# EAGLE design pentalight_1layer (EAGLE 5.11)
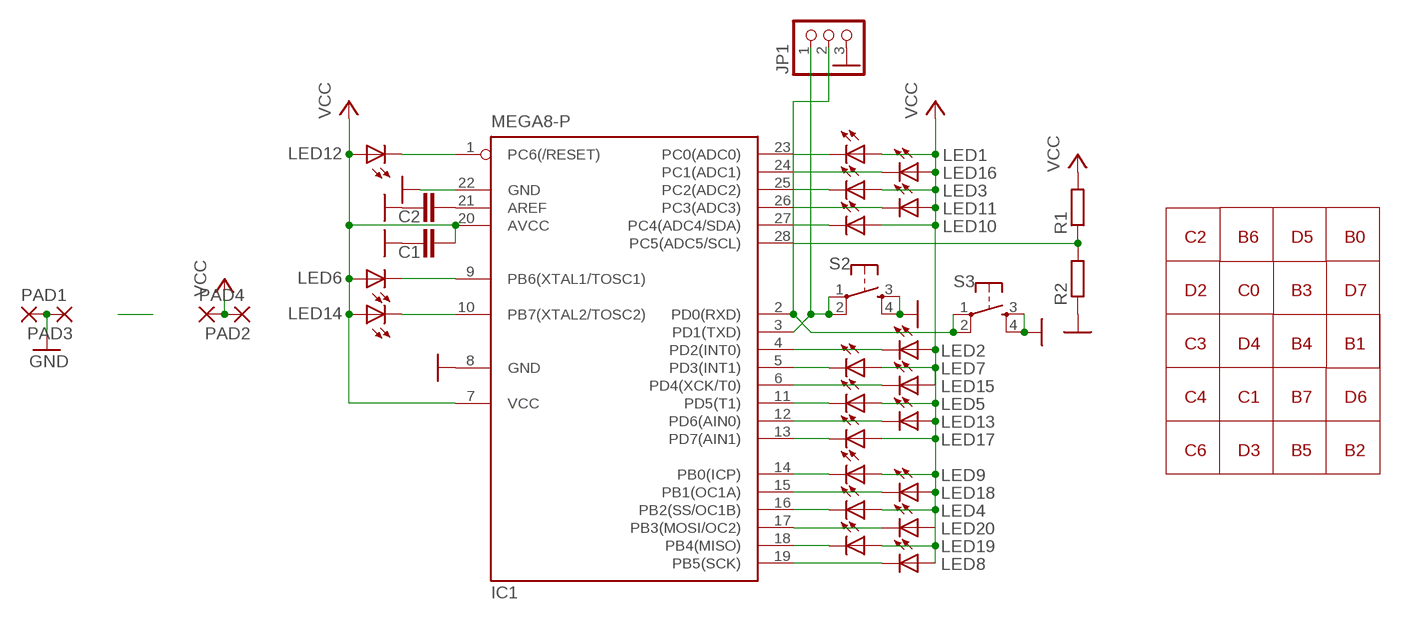
[diagram p0: schematic, sheet 1]

## Parts
C1  C-EU025-024X044  [C025-024X044]
C2  C-EU025-024X044  [C025-024X044]
IC1  MEGA8-P  [DIL28-3]
JP1  PINHD-1X3  [1X03]
LED1  LED5MM  [LED5MM]
LED2  LED5MM  [LED5MM]
LED3  LED5MM  [LED5MM]
LED4  LED5MM  [LED5MM]
LED5  LED5MM  [LED5MM]
LED6  LED5MM  [LED5MM]
LED7  LED5MM  [LED5MM]
LED8  LED5MM  [LED5MM]
LED9  LED5MM  [LED5MM]
LED10  LED5MM  [LED5MM]
LED11  LED5MM  [LED5MM]
LED12  LED5MM  [LED5MM]
LED13  LED5MM  [LED5MM]
LED14  LED5MM  [LED5MM]
LED15  LED5MM  [LED5MM]
LED16  LED5MM  [LED5MM]
LED17  LED5MM  [LED5MM]
LED18  LED5MM  [LED5MM]
LED19  LED5MM  [LED5MM]
LED20  LED5MM  [LED5MM]
PAD1  SMD5  [SMD2,54-5,08]
PAD2  SMD5  [SMD2,54-5,08]
PAD3  2,54/1,0  [2,54/1,0]
PAD4  2,54/1,0  [2,54/1,0]
R1  R-EU_0204/7  [0204/7]
R2  R-EU_0204/7  [0204/7]
S2  TAC_SWITCHPTH  [TACTILE-PTH]
S3  TAC_SWITCHPTH  [TACTILE-PTH]

## Nets
GND: C1.1 C2.1 IC1.8(GND) IC1.22(GND) JP1.3 PAD1.1(P) PAD3.1(P) R2.1 S2.3 S2.4 S3.3 S3.4
N$1: IC1.18(PB4(MISO)) LED19.K(C)
N$2: IC1.17(PB3(MOSI/OC2)) LED20.K(C)
N$3: IC1.23(PC0(ADC0)) LED1.K(C)
N$4: IC1.4(PD2(INT0)) LED2.K(C)
N$5: IC1.25(PC2(ADC2)) LED3.K(C)
N$6: IC1.16(PB2(SS/OC1B)) LED4.K(C)
N$7: IC1.11(PD5(T1)) LED5.K(C)
N$8: IC1.9(PB6(XTAL1/TOSC1)) LED6.K(C)
N$9: IC1.5(PD3(INT1)) LED7.K(C)
N$10: IC1.19(PB5(SCK)) LED8.K(C)
N$11: IC1.14(PB0(ICP)) LED9.K(C)
N$12: IC1.26(PC3(ADC3)) LED11.K(C)
N$13: IC1.27(PC4(ADC4/SDA)) LED10.K(C)
N$14: IC1.1(PC6(/RESET)) LED12.K(C)
N$16: IC1.10(PB7(XTAL2/TOSC2)) LED14.K(C)
N$17: C2.2 IC1.21(AREF)
N$18: IC1.24(PC1(ADC1)) LED16.K(C)
N$19: IC1.13(PD7(AIN1)) LED17.K(C)
N$20: IC1.15(PB1(OC1A)) LED18.K(C)
N$21: IC1.12(PD6(AIN0)) LED13.K(C)
N$22: IC1.6(PD4(XCK/T0)) LED15.K(C)
N$23: IC1.28(PC5(ADC5/SCL)) R1.1 R2.2
N$27: IC1.3(PD1(TXD)) JP1.1 S2.1 S2.2
N$28: IC1.2(PD0(RXD)) JP1.2 S3.1 S3.2
VCC: C1.2 IC1.7(VCC) IC1.20(AVCC) LED1.A LED2.A LED3.A LED4.A LED5.A LED6.A LED7.A LED8.A LED9.A LED10.A LED11.A LED12.A LED13.A LED14.A LED15.A LED16.A LED17.A LED18.A LED19.A LED20.A PAD2.1(P) PAD4.1(P) R1.2

## Notes on the sheet
- C2 | B6 | D5 | B0
- D2 | C0 | B3 | D7
- C3 | D4 | B4 | B1
- C4 | C1 | B7 | D6
- C6 | D3 | B5 | B2

## Library data of the parts
C1 C2 = resistor:C-EU: CAPACITOR, European symbol
IC1 = atmel:MEGA8-P: MICROCONTROLLER 8 Kbytes FLASH, 1 kbytes SRAM, 512 bytes EEPROM, USART, 4-channel 10 bit ADC, 2-channel 8 bit ADC Pin compatible with Atmega48, ATMega88, ATMega168 Source: avr.lbr; OC_FARNELL: unknown; OC_NEWARK: unknown
JP1 = pinhead:PINHD-1X3: PIN HEADER
LED1-LED20 = SparkFun:LED: LEDs Standard schematic elements and footprints for 5mm, 3mm, 1206, and 0603 sized LEDs. 5mm - Spark Fun Electronics SKU : COM-00529 (and others)
PAD1 PAD2 = wirepad:SMD5: SMD PAD
PAD3 PAD4 = wirepad:2,54/1,0: THROUGH-HOLE PAD
R1 R2 = resistor:R-EU_: RESISTOR, European symbol
S2 S3 = SparkFun:TAC_SWITCH: Momentary Switch Button commonly used for reset or general input. Spark Fun Electronics SKU : COM-00097

## Board
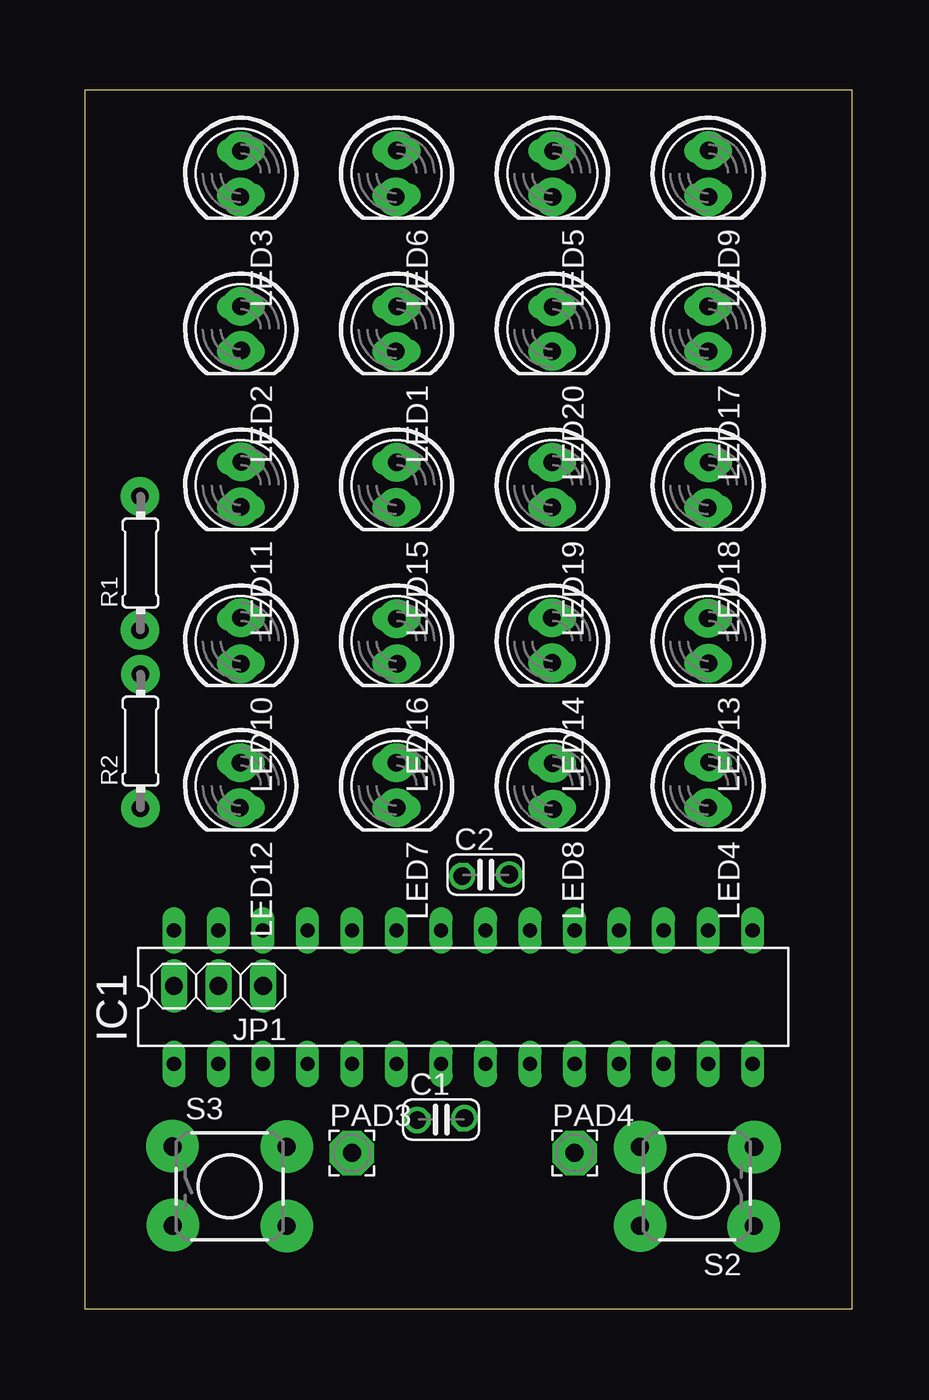
[diagram p1: board, top side]
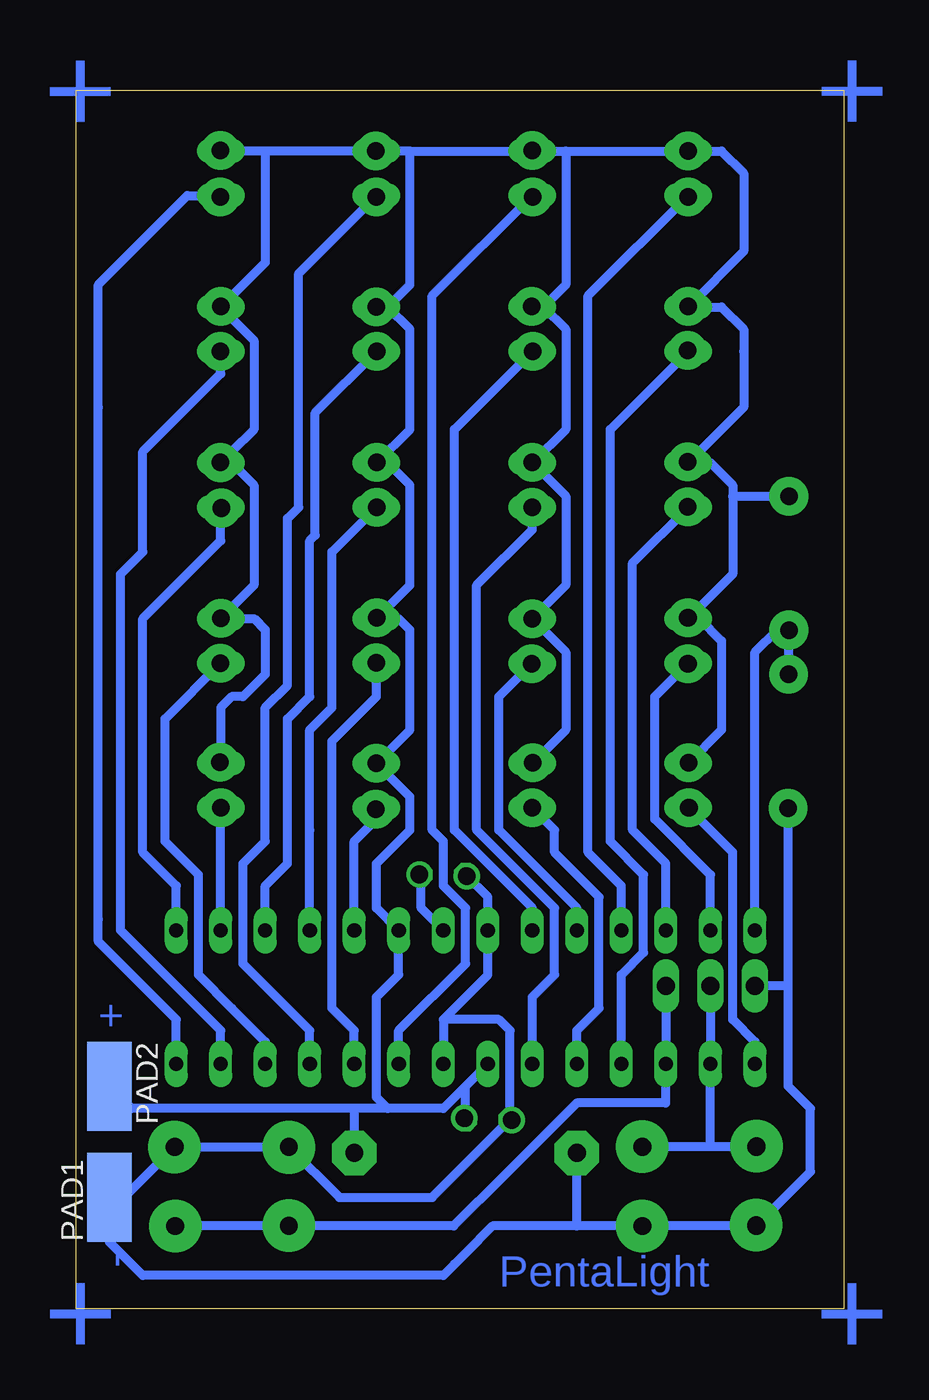
[diagram p2: board, bottom side, seen from below]

Size 43.8 x 69.52 mm. Coordinates in mm from the lower left corner, seen from the top.
Outline: 0,0 43.8,0 43.8,69.52 0,69.52 0,0
Copper layers (1*16): Top 0.035mm / dielectric 1.5mm / Bottom 0.035mm
Design rules "default": minimum track width 10mil, minimum drill 24mil, track to track 8mil, track to pad 8mil, pad to pad 8mil, via to via 8mil, smd to smd 8mil, copper to edge 40mil, drill to drill 8mil, minimum pad ring 10mil, minimum via ring 8mil, stop-mask expansion 4mil, vias tented up to drill 0mil, thermal gap 10mil

### Footprints (pad centres in the part's own frame; a part is rotated, then mirrored left to right if it is on the bottom)
C025-024X044 = drill 0.813 octagon: 1 -1.27,0; 2 1.27,0
DIL28-3 = drill 0.813 long: 1 -16.51,-3.81; 2 -13.97,-3.81; 3 -11.43,-3.81; 4 -8.89,-3.81; 5 -6.35,-3.81; 6 -3.81,-3.81; 7 -1.27,-3.81; 8 1.27,-3.81; 9 3.81,-3.81; 10 6.35,-3.81; 11 8.89,-3.81; 12 11.43,-3.81; 13 13.97,-3.81; 14 16.51,-3.81; 15 16.51,3.81; 16 13.97,3.81; 17 11.43,3.81; 18 8.89,3.81; 19 6.35,3.81; 20 3.81,3.81; 21 1.27,3.81; 22 -1.27,3.81; 23 -3.81,3.81; 24 -6.35,3.81; 25 -8.89,3.81; 26 -11.43,3.81; 27 -13.97,3.81; 28 -16.51,3.81
1X03 = drill 1.016 long: 1 -2.54,0; 2 0,0; 3 2.54,0
LED5MM = drill 0.813 pad 1.372 long: A -1.27,0; K 1.27,0
SMD2,54-5,08 = smd 2.54 x 5.08: 1 0,0
2,54/1,0 = drill 1.016 pad 2.54 octagon: 1 0,0
0204/7 = drill 0.813 octagon: 1 -3.81,0; 2 3.81,0
TACTILE-PTH = drill 1.016 pad 1.88 round: 1 -3.251,2.261; 2 3.251,2.261; 3 -3.251,-2.261; 4 3.251,-2.261

### Placement (x,y rotation side)
C1  20.32,10.79 0 top
C2  22.86,24.77 0 top
IC1  21.59,17.78 0 top
JP1  7.62,18.41 180 top
LED1  17.78,55.88 270 top
LED2  8.89,55.88 270 top
LED3  8.89,64.77 270 top
LED4  35.56,29.84 270 top
LED5  26.67,64.77 270 top
LED6  17.78,64.77 270 top
LED7  17.78,29.84 270 top
LED8  26.67,29.84 270 top
LED9  35.56,64.77 270 top
LED10  8.89,38.1 270 top
LED11  8.89,46.99 270 top
LED12  8.89,29.84 270 top
LED13  35.56,38.1 270 top
LED14  26.67,38.1 270 top
LED15  17.78,46.99 270 top
LED16  17.78,38.1 270 top
LED17  35.56,55.88 270 top
LED18  35.56,46.99 270 top
LED19  26.67,46.99 270 top
LED20  26.67,55.88 270 top
PAD1  41.91,6.35 0 bottom
PAD2  41.91,12.7 180 bottom
PAD3  15.24,8.89 0 top
PAD4  27.94,8.89 0 top
R1  3.17,42.55 90 top
R2  3.17,32.38 90 top
S2  34.92,6.99 180 top
S3  8.25,6.99 0 top

### Tracks (layer width: path | path; a pad name or v marks a point on that pad's centre or on a via)
GND
  Bottom 0.5: 22.86,16.51 IC1.8 | 22.86,16.51 20.32,19.05 IC1.22 20.32,23.5 C2.1 | 22.86,16.51 19.69,16.51 19.05,15.88 C1.1 23.49,6.35 25.4,6.35 28.78,6.35 S2.4 S2.3 41.07,6.35 PAD1.1 | 15.24,4.72 S3.4 S3.3 1.9,7.82 1.9,11.43 3.17,12.7 3.17,18.41 | 15.24,4.72 20.04,4.72 21.59,3.17 22.22,2.54 22.86,1.91 40,1.91 41.91,3.81 PAD1.1 | PAD1.1 41.27,5.71 | 3.17,18.41 R2.1 | 15.24,4.72 PAD3.1 | 3.17,18.41 JP1.3
N$1
  Bottom 0.5: LED19.K 29.21,43.18 29.21,34.29 30.48,33.02 30.48,27.3 IC1.18
N$2
  Bottom 0.5: LED20.K 30.16,51.12 30.16,44.13 30.48,43.81 30.48,34.92 31.75,33.66 31.75,25.4 33.02,24.13 IC1.17
N$3
  Bottom 0.5: LED1.K 22.22,50.16 22.22,27.3 17.78,22.86 IC1.23
N$4
  Bottom 0.5: LED2.K 13.33,50.16 13.33,26.67 11.43,24.77 11.43,20.32 12.7,19.05 IC1.4
N$5
  Bottom 0.5: LED3.K 14.6,57.78 14.6,26.04 12.7,24.13 IC1.25
N$6
  Bottom 0.5: IC1.16 LED4.K
N$7
  Bottom 0.5: LED5.K 31.11,59.05 31.11,45.72 31.75,45.09 31.75,35.56 33.02,34.29 33.02,26.67 34.29,25.4 34.29,19.68 30.48,15.88 IC1.11
N$8
  Bottom 0.5: LED6.K 23.49,57.78 23.49,27.3 22.86,26.67 22.86,24.13 21.59,22.86 21.59,19.68 25.4,15.88 IC1.9
N$9
  Bottom 0.5: LED7.K 16.51,27.3 16.51,26.04 13.97,23.5 13.97,17.14 15.24,15.88 IC1.5
N$10
  Bottom 0.5: LED8.K 26.67,27.94 27.94,26.67 IC1.19
N$11
  Bottom 0.5: IC1.14 38.1,16.51 42.55,20.95 42.55,22.23 42.55,51.44 42.55,58.42 37.47,63.5 LED9.K
N$12
  Bottom 0.5: LED11.K 12.06,42.55 12.06,27.3 10.16,25.4 IC1.26
N$13
  Bottom 0.5: LED10.K 10.8,34.92 10.8,27.94 7.62,24.77 IC1.27
N$14
  Bottom 0.5: LED12.K 6.35,26.04 6.35,16.51 5.08,15.24 IC1.1
N$16
  Bottom 0.5: IC1.10 27.94,15.88 29.21,17.14 29.21,27.3 29.21,32.38 26.67,34.92 LED14.K
N$17
  Bottom 0.5: C2.2 24.13,22.86 IC1.21
N$18
  Bottom 0.5: LED16.K 19.69,34.92 19.69,27.3 15.24,22.86 IC1.24
N$19
  Bottom 0.5: IC1.13 35.56,15.88 41.27,21.59 41.27,41.91 40,43.18 40,48.9 35.56,53.34 LED17.K
N$20
  Bottom 0.5: IC1.15 38.1,24.13 40,26.04 40,39.37 35.56,43.81 LED18.K
N$21
  Bottom 0.5: LED13.K 38.73,33.66 38.73,26.67 36.83,24.77 36.83,19.05 34.92,17.14 33.02,15.24 IC1.12
N$22
  Bottom 0.5: LED15.K 17.78,44.45 20.95,41.27 20.95,27.3 16.51,22.86 16.51,19.05 17.78,17.78 IC1.6
N$23
  Bottom 0.5: IC1.28 5.08,37.47 3.81,38.73 R1.1 R2.2
N$24  (via drill 1 pad 3)
  other vias: 5.01,4.77
N$25  (via drill 1 pad 3)
  other vias: 11.51,4.72
N$26  (via drill 1 pad 3)
  other vias: 4.99,9.28
N$27
  Bottom 0.5: S2.1 S2.2 22.26,4.72 19.37,7.62 16.83,10.16 15.24,11.75 10.16,11.75 IC1.3 JP1.1
N$28
  Bottom 0.5: S3.1 7.62,9.25 | 7.62,9.25 S3.2 | 7.62,9.25 7.62,13.82 7.54,13.89 IC1.2 JP1.2
N$29  (via drill 1 pad 3)
  other vias: 11.51,9.26
N$30  (via drill 1 pad 3)
  other vias: 31.68,4.75
N$31  (via drill 1 pad 3)
  other vias: 38.15,4.73
N$32  (via drill 1 pad 3)
  other vias: 38.2,9.24
N$33  (via drill 1 pad 3)
  other vias: 31.68,9.21
N$34  (via drill 1 pad 2.2)
  other vias: 3.18,28.57
N$35  (via drill 1 pad 2.2)
  other vias: 3.16,36.21
N$36  (via drill 1 pad 2.2)
  other vias: 3.14,38.72
N$37  (via drill 1 pad 2.2)
  other vias: 3.14,46.35
N$38  (via drill 1 pad 2.2)
  other vias: 8.89,66.06
N$39  (via drill 1 pad 2.2)
  other vias: 17.8,66.08
N$40  (via drill 1 pad 2.2)
  other vias: 26.71,66.04
N$41  (via drill 1 pad 2.2)
  other vias: 35.58,66.07
N$42  (via drill 1 pad 2.2)
  other vias: 35.55,57.19
N$43  (via drill 1 pad 2.2)
  other vias: 26.68,57.17
N$44  (via drill 1 pad 2.2)
  other vias: 17.82,57.18
N$45  (via drill 1 pad 2.2)
  other vias: 8.89,57.18
N$46  (via drill 1 pad 2.2)
  other vias: 8.92,48.31
N$47  (via drill 1 pad 2.2)
  other vias: 17.79,48.29
N$48  (via drill 1 pad 2.2)
  other vias: 26.66,48.3
N$49  (via drill 1 pad 2.2)
  other vias: 35.59,48.28
N$50  (via drill 1 pad 2.2)
  other vias: 35.54,39.38
N$51  (via drill 1 pad 2.2)
  other vias: 26.64,39.43
N$52  (via drill 1 pad 2.2)
  other vias: 17.8,39.36
N$53  (via drill 1 pad 2.2)
  other vias: 8.9,39.43
N$54  (via drill 1 pad 2.2)
  other vias: 8.86,31.14
N$55  (via drill 1 pad 2.2)
  other vias: 17.76,31.14
N$56  (via drill 1 pad 2.2)
  other vias: 26.69,31.11
N$57  (via drill 1 pad 2.2)
  other vias: 35.61,31.17
N$58  (via drill 1 pad 2.2)
  other vias: 35.55,28.59
N$59  (via drill 1 pad 2.2)
  other vias: 26.71,28.5
N$60  (via drill 1 pad 2.2)
  other vias: 17.8,28.59
N$61  (via drill 1 pad 2.2)
  other vias: 8.85,28.57
N$62  (via drill 1 pad 2.2)
  other vias: 8.9,36.8
N$63  (via drill 1 pad 2.2)
  other vias: 17.82,36.8
N$64  (via drill 1 pad 2.2)
  other vias: 26.67,36.84
N$65  (via drill 1 pad 2.2)
  other vias: 35.59,36.83
N$66  (via drill 1 pad 2.2)
  other vias: 35.53,45.68
N$67  (via drill 1 pad 2.2)
  other vias: 26.66,45.72
N$68  (via drill 1 pad 2.2)
  other vias: 17.78,45.71
N$69  (via drill 1 pad 2.2)
  other vias: 8.91,45.75
N$70  (via drill 1 pad 2.2)
  other vias: 35.57,54.62
N$71  (via drill 1 pad 2.2)
  other vias: 26.66,54.62
N$72  (via drill 1 pad 2.2)
  other vias: 17.75,54.62
N$73  (via drill 1 pad 2.2)
  other vias: 8.92,54.68
N$74  (via drill 1 pad 2.2)
  other vias: 35.59,63.43
N$75  (via drill 1 pad 2.2)
  other vias: 26.68,63.43
N$76  (via drill 1 pad 2.2)
  other vias: 17.75,63.44
N$77  (via drill 1 pad 2.2)
  other vias: 8.88,63.44
N$78  (via drill 1 pad 1)
  other vias: 24.22,24.78
N$79  (via drill 1 pad 1)
  other vias: 21.52,24.68
N$80  (via drill 1 pad 1)
  other vias: 18.96,10.76
N$81  (via drill 1 pad 1)
  other vias: 21.66,10.88
VCC
  Bottom 0.5: 34.92,48.26 33.66,46.99 33.66,41.27 LED13.A 33.66,39.37 33.02,38.73 33.02,36.2 34.29,34.92 34.92,34.92 35.56,34.29 LED4.A | 34.92,48.26 LED18.A | 34.92,48.26 34.92,48.9 33.66,50.16 33.66,55.24 LED17.A 33.02,59.69 33.02,66.04 | 26.03,57.15 24.77,58.42 24.77,66.04 | 26.03,57.15 24.77,55.88 24.77,50.16 LED19.A 26.03,48.26 24.77,46.99 24.77,41.27 LED14.A 25.4,39.37 24.77,38.73 24.77,33.02 LED8.A 24.77,29.21 24.77,27.3 26.67,25.4 26.67,22.86 IC1.20 25.4,19.05 26.67,17.78 26.67,12.06 26.03,11.43 | 26.03,57.15 LED20.A | 33.02,66.04 LED5.A 24.77,66.04 | 33.02,66.04 LED9.A | 8.25,31.11 LED12.A 6.98,33.02 6.98,38.1 8.25,39.37 LED10.A 6.35,41.91 6.35,46.35 | 24.77,66.04 LED6.A 15.88,66.04 | 17.14,57.15 15.88,58.42 15.88,66.04 | 17.14,57.15 15.88,55.88 15.88,50.16 LED15.A 15.88,46.35 15.88,41.27 LED16.A 15.88,37.47 15.88,33.02 LED7.A | 6.35,46.35 6.35,46.99 7.62,48.26 LED11.A 5.71,51.44 5.71,54.61 5.71,55.88 6.98,57.15 8.25,57.15 LED2.A 5.71,60.33 5.71,64.77 6.98,66.04 LED3.A 15.88,66.04 | 17.14,57.15 LED1.A | 6.35,46.35 R1.2 | 21.59,12.7 IC1.7 | 21.59,12.7 22.86,11.43 26.03,11.43 | C1.2 21.59,12.7 | PAD2.1 40.64,11.43 27.94,11.43 | 26.03,11.43 27.94,11.43 | 27.94,11.43 PAD4.1

### Text on the board
Bottom: + | + | + | - | PentaLight | + | +